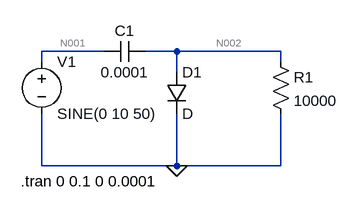
[diagram p0: schematic clamper.asc]
clamper.asc, the LTspice schematic file:
Version 4
SHEET 1 880 680
WIRE 0 48 -96 48
WIRE 112 48 64 48
WIRE 272 48 112 48
WIRE -96 64 -96 48
WIRE 272 64 272 48
WIRE 112 80 112 48
WIRE -96 224 -96 144
WIRE 112 224 112 144
WIRE 112 224 -96 224
WIRE 272 224 272 144
WIRE 272 224 112 224
FLAG 112 224 0
SYMBOL cap 0 64 R270
WINDOW 0 32 32 VTop 2
WINDOW 3 0 32 VBottom 2
SYMATTR InstName C1
SYMATTR Value 0.0001
SYMBOL diode 96 80 R0
SYMATTR InstName D1
SYMBOL res 256 48 R0
SYMATTR InstName R1
SYMATTR Value 10000
SYMBOL voltage -96 48 R0
WINDOW 123 0 0 Left 2
WINDOW 39 0 0 Left 2
SYMATTR InstName V1
SYMATTR Value SINE(0 10 50)
TEXT -128 248 Left 2 !.tran 0 0.1 0 0.0001

The netlist it stands for:
* clamper.asc
C1 N001 N002 0.0001
D1 N002 0 D
R1 N002 0 10000
V1 N001 0 SINE(0 10 50)
.model D D
.lib standard.dio
.tran 0 0.1 0 0.0001
.backanno
.end

* Results of the author's LTspice run, read from the files saved beside the schematic
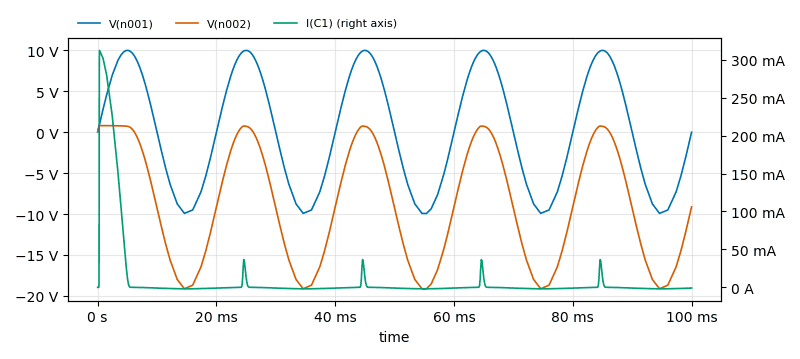
[diagram p1: Transient Analysis of clamper.asc, plotted from the saved traces]
* Transient Analysis, 1 run:
*   V(n001): min -9.937 V, max 9.998 V, average 31.21 mV, rms 7.051 V, last 0 V
*   V(n002): min -19.14 V, max 803.7 mV, average -8.999 V, rms 11.53 V, last -9.127 V
*   I(C1): min -1.914 mA, max 312.4 mA, average 9.086 mA, rms 47.3 mA, last -912.7 µA